# EAGLE board CajitaAbierta_v42 (EAGLE 9.6.2)
REV: A
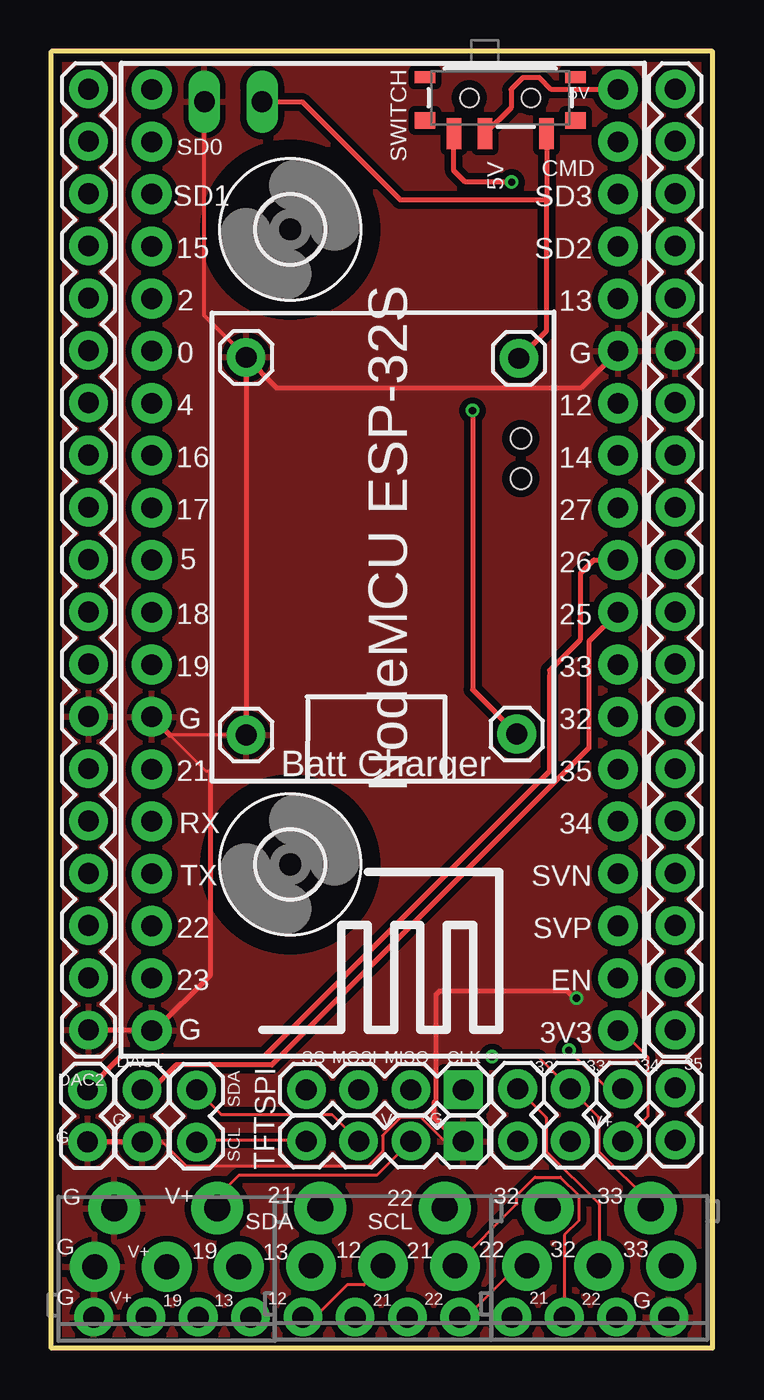
[diagram p0: board, top side]
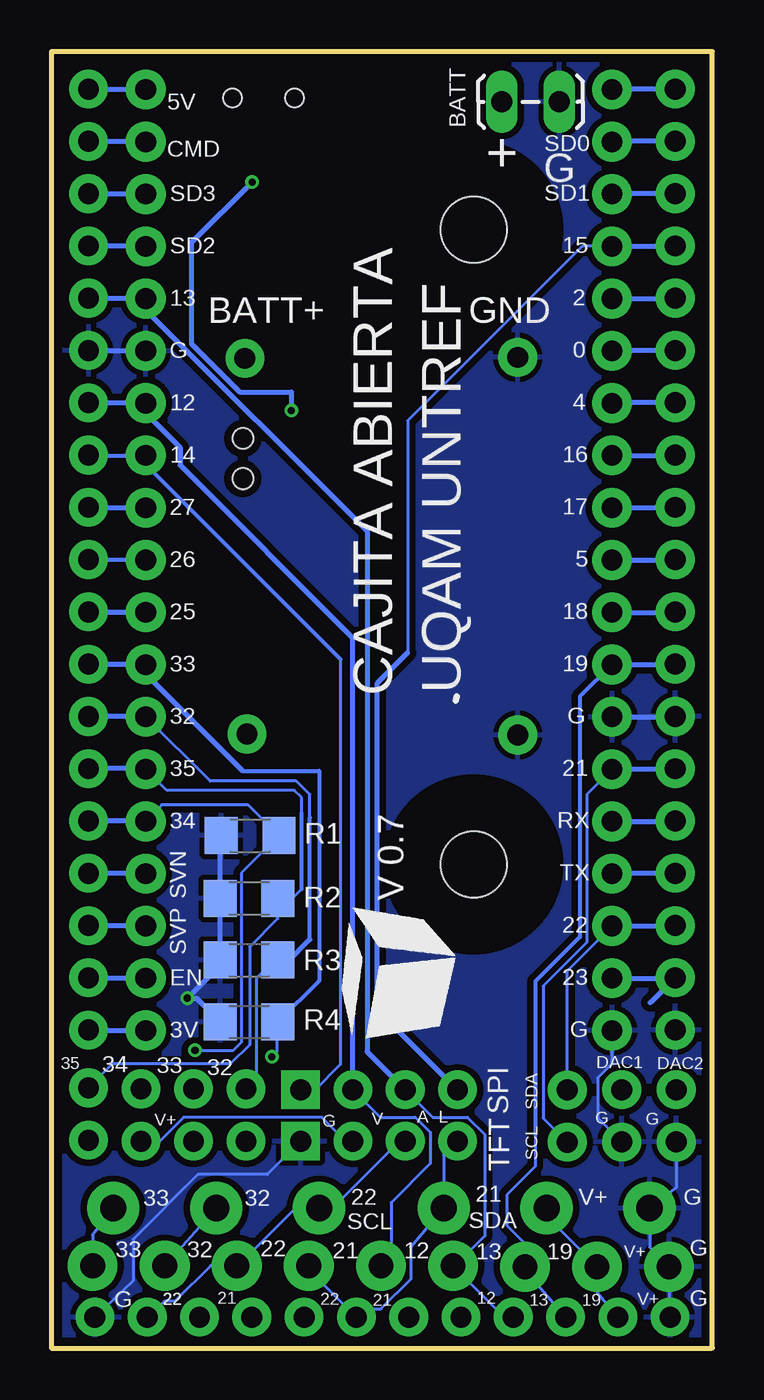
[diagram p1: board, bottom side, seen from below]

Size 32.1 x 63 mm. Coordinates in mm from the lower left corner, seen from the top.
Outline: 32.1,63 32.1,0 0,0 0,63 32.1,63
Copper layers (1*16): Top 0.035mm / dielectric 1.5mm / Bottom 0.035mm
Design rules "NOA Eagle Rule 2016-06-12": minimum track width 6mil, minimum drill 0.3mm, track to track 6mil, track to pad 6mil, pad to pad 6mil, via to via 6mil, smd to smd 0mil, copper to edge 0.4mm, drill to drill 10mil, minimum pad ring 10mil, minimum via ring 6mil, stop-mask expansion 2mil, vias tented up to drill 25mil, thermal gap 10mil
Holes 1 mm at 22.8,44.2 22.8,42.25

## Footprints (pad centres in the part's own frame; a part is rotated, then mirrored left to right if it is on the bottom)
1X01 = drill 1.016 pad 1.88: 1 0,0
1X02 = drill 1.016 pad 1.88: 1 0,0; 2 2.54,0
1X02_LOCK_LONGPADS = drill 1.016 long: 1 -0.127,0; 2 2.667,0
1X12_NO_SILK = drill 1.016 pad 1.88: 1 0,0; 2 2.54,0; 3 5.08,0; 4 7.62,0; 5 10.16,0; 6 12.7,0; 7 15.24,0; 8 17.78,0; 9 20.32,0; 10 22.86,0; 11 25.4,0; 12 27.94,0
1X19 = drill 1.016 pad 1.88: 1 0,0; 2 2.54,0; 3 5.08,0; 4 7.62,0; 5 10.16,0; 6 12.7,0; 7 15.24,0; 8 17.78,0; 9 20.32,0; 10 22.86,0; 11 25.4,0; 12 27.94,0; 13 30.48,0; 14 33.02,0; 15 35.56,0; 16 38.1,0; 17 40.64,0; 18 43.18,0; 19 45.72,0
1206 = smd 1.6 x 1.8: 1 -1.4,0; 2 1.4,0
1X04 = drill 1.016 pad 1.88 square: 1 0,0 | drill 1.016 pad 1.88: 2 2.54,0; 3 5.08,0; 4 7.62,0
SWITCH_SPST_SMD_A = smd 0.7 x 1.5: 1 -2.25,-1.75; 2 -0.75,-1.75; 3 2.25,-1.75 | smd 1 x 0.6: GND1 -3.65,1; GND3 3.65,1 | smd 1 x 0.8: GND2 -3.65,-1.1; GND4 3.65,-1.1 | hole 0.9: -1.5,0; 1.5,0
SCREWTERMINAL-3.5MM-3-NS = drill 1.2 pad 2.413: 1 0,0; 2 3.5,0; 3 7,0
3,2 = hole 3.2: 0,0
ESP32-DEVKITC = drill 1 pad 1.93: 1 -22.87,-11.42; 2 -20.33,-11.42; 3 -17.79,-11.42; 4 -15.25,-11.42; 5 -12.71,-11.42; 6 -10.17,-11.42; 7 -7.63,-11.42; 8 -5.09,-11.42; 9 -2.55,-11.42; 10 -0.01,-11.42; 11 2.53,-11.42; 12 5.07,-11.42; 13 7.61,-11.42; 14 10.15,-11.42; 15 12.69,-11.42; 16 15.23,-11.42; 17 17.77,-11.42; 18 20.31,-11.42; 19 22.85,-11.42; 20 22.85,11.23; 21 20.31,11.23; 22 17.77,11.23; 23 15.23,11.23; 24 12.69,11.23; 25 10.15,11.23; 26 7.61,11.23; 27 5.07,11.23; 28 2.53,11.23; 29 -0.01,11.23; 30 -2.55,11.23; 31 -5.09,11.23; 32 -7.63,11.23; 33 -10.17,11.23; 34 -12.71,11.23; 35 -15.25,11.23; 36 -17.79,11.23; 37 -20.33,11.23; 38 -22.87,11.23
SCREW_TERMINAL_3_POS_5MM = drill 1.27 pad 2.54: 1 0,0; 2 0,5; 3 0,10

## Placement (x,y rotation side)
5V_IN  5V_IN  [1X01]  22.6,29.84 0 top
32  [1X02]  22.65,10.05 90 top
33  [1X02]  25.2,10.05 90 top
34  [1X02]  27.75,10.05 90 top
35  [1X02]  30.3,10.1 90 top
BAT-  [1X01]  9.45,29.79 0 top
BATT  [1X02_LOCK_LONGPADS]  7.56,60.56 180 bottom
BATT+  [1X01]  22.7,48.09 0 top
DAC1  [1X02]  4.4,12.55 270 top
DAC2  [1X02]  1.75,12.55 270 top
GND  Batt Charger  [1X01]  9.45,48.14 0 top
I2C  [1X02]  7.05,10 90 top
J1  [1X12_NO_SILK]  2.05,1.5 0 top
JP9  [1X19]  30.3,15.45 90 top
JP10  [1X19]  1.8,15.45 90 top
R1  [1206]  22.45,24.9 0 bottom
R2  [1206]  22.5,21.85 0 bottom
R3  [1206]  22.5,18.85 0 bottom
R4  [1206]  22.5,15.85 0 bottom
SPI  [1X04]  20,12.55 180 top
SWITCH  [SWITCH_SPST_SMD_A]  21.8,60.75 0 top
T1  [SCREWTERMINAL-3.5MM-3-NS]  2.1,3.95 0 top
T2  [SCREWTERMINAL-3.5MM-3-NS]  12.6,4 0 top
T3  [SCREWTERMINAL-3.5MM-3-NS]  23.1,4 0 top
TFT  [1X04]  20,10.05 180 top
U$1  [3,2]  11.6,54.35 0 top
U$2  [3,2]  11.6,23.5 0 top
U$3  ESP32DEVKITC  [ESP32-DEVKITC]  16.1,38.3 90 top
U$4  SCREW_TERMINAL_3_POS_5MM  [SCREW_TERMINAL_3_POS_5MM]  3.05,6.8 270 top
U$5  SCREW_TERMINAL_3_POS_5MM  [SCREW_TERMINAL_3_POS_5MM]  19.1,6.8 270 top

## Library data of the parts
5V_IN 32-35 BAT- BATT BATT+ DAC1 DAC2 GND I2C J1 JP9 JP10 SPI T1-T3 TFT = SparkFun-Connectors
R1-R4 = SparkFun-Resistors
SWITCH = SparkFun-Switches; PROD_ID: SWCH-10651; SF_SKU: COM-10860
U$1 U$2 = holes
U$3 = ESP32-DEVKITC
U$4 U$5 = alx_lib

## Nets
3V3: 34.1 J1.2 JP9.1 T1.2 TFT.2 U$3.1 U$4.2
5V: JP9.19 SWITCH.2 U$3.19
5V_IN: 5V_IN.1 SWITCH.1
ADC4: 32.2 JP9.7 R3.2 T3.2 U$3.7 U$5.2
ADC5: 33.2 JP9.8 R4.2 T3.3 U$3.8 U$5.3
ADC6: 34.2 JP9.5 R1.2 U$3.5
ADC7: 35.2 JP9.6 R2.2 U$3.6
BATT+: BATT+.1 BATT.2 SWITCH.3
CLK: JP10.19 U$3.20
CMD: JP9.18 U$3.18
D1: JP10.2 U$3.37
D2: J1.3 JP10.8 T1.3 U$3.31
D3: JP10.9 U$3.30
D4: JP10.10 U$3.29
D5: JP10.13 U$3.26
D6: JP10.14 U$3.25
D7: JP9.11 U$3.11
D8: JP10.15 U$3.24
DAC1: DAC1.1 JP9.9 U$3.9
DAC2: DAC2.1 JP9.10 U$3.10
EN: JP9.2 U$3.2
GND: BAT-.1 BATT.1 DAC1.2 DAC2.2 GND.1 J1.1 J1.12 JP9.14 JP10.1 JP10.7 R1.1 R2.1 R3.1 R4.1 T1.1 TFT.1 U$3.14 U$3.32 U$3.38 U$4.1
I2C_SCL: I2C.2 J1.8 J1.11 JP10.3 T3.1 TFT.3 U$3.36 U$5.1
I2C_SDA: I2C.1 J1.7 J1.10 JP10.6 T2.3 TFT.4 U$3.33 U$4.3
IO16: JP10.12 U$3.27
IO17: JP10.11 U$3.28
MISO: J1.5 JP9.13 SPI.2 T2.2 U$3.13
MOSI: J1.4 JP9.15 SPI.3 T2.1 U$3.15
N$14: J1.6
N$17: J1.9
RXD0: JP10.5 U$3.34
SD0: JP10.18 U$3.21
SD1: JP10.17 U$3.22
SD2: JP9.16 U$3.16
SD3: JP9.17 U$3.17
SPI_CLK: JP9.12 SPI.1 U$3.12
SPI_SS: JP10.16 SPI.4 U$3.23
SVN: JP9.4 U$3.4
SVP: JP9.3 U$3.3
TXD0: JP10.4 U$3.35

## Tracks (layer width: path | path; a pad name or v marks a point on that pad's centre or on a via)
3V3
  Top 0.152: U$3.1 27.67,15.43 28.95,14.15 28.95,11.25 34.1 27.8,10.1 | TFT.2 15.81,8.4 9.1,8.4 8.05,7.35 U$4.2
  Bottom 0.152: U$4.2 8.05,6.4 T1.2 5.6,2.71 J1.2 | TFT.2 17.8,10.05 18.97,11.22 25.68,11.22 26.85,10.05 34.1
  Bottom 0.254: JP9.1 30.28,15.43 U$3.1
5V
  Top 0.254: U$3.19 24.28,61.15 23.7,61.73 22.89,61.73 22.32,61.16 22.32,60.27 SWITCH.2
  Bottom 0.254: U$3.19 30.28,61.15 JP9.19
5V_IN  (via drill 0.35)
  Top 0.254: v20.45,45.55 20.45,31.99 5V_IN.1 | v22.35,56.65 20.1,56.65 19.55,57.2 SWITCH.1
  Bottom 0.254: v22.35,56.65 25.3,53.7 25.3,48.8 22.95,46.45 20.45,46.45 v20.45,45.55
ADC4
  Top 0.152: 32.2 24.03,11.21 24.03,9.57 26.6,7 T3.2
  Bottom 0.152: 21.2,18.75 R3.2 21.26,18.85 22.15,17.96 22.15,13.09 32.2 | 19.55,25.78 19.55,26.9 20.2,27.55 24.4,27.55 27.54,30.69 | U$5.2 T3.2
  Bottom 0.2: 19.55,19.85 19.55,25.78
  Bottom 0.254: U$3.7 27.54,30.69 JP9.7 | 19.55,19.85 20.65,18.75 21.2,18.75
ADC5  (via drill 0.35)
  Top 0.152: v21.4,14.15 23.64,14.15 33.2 26.58,11.21 26.58,9.57 29.1,7.05 U$5.3
  Bottom 0.152: R4.2 21.15,15.8 21.15,14.4 v21.4,14.15 | U$5.3 30.1,5.5 T3.3
  Bottom 0.2: 22.8,28.04 19.1,28.04 19.1,17.85 R4.2
  Bottom 0.254: 22.8,28.04 27.52,32.76 U$3.8 27.54,33.23 JP9.8
ADC6  (via drill 0.35)
  Top 0.152: 34.2 27.01,12.59 v25.13,14.47
  Bottom 0.152: v25.13,14.47 23.26,14.47 22.87,14.86 22.87,23.08 R1.2 22.55,26.4 26.75,26.4 27.54,25.61
  Bottom 0.254: U$3.5 27.54,25.61 JP9.5
ADC7
  Bottom 0.152: 19.95,22.3 20.4,21.85 R2.2 21.1,20.87 22.48,19.49 22.48,14.73 23.41,13.8 29.14,13.8 35.2 | 19.95,25.99 19.95,26.75 20.3,27.1 26.49,27.1 U$3.6
  Bottom 0.2: 19.95,22.3 19.95,25.99
  Bottom 0.254: U$3.6 27.54,28.15 JP9.6
BATT+
  Top 0.254: 24.05,55.85 24.11,55.79 16.94,55.79 12.18,60.56 BATT.2 | SWITCH.3 24.05,55.85 | BATT+.1 24.05,49.43 24.05,55.85
CLK
  Bottom 0.254: JP10.19 4.85,61.17 U$3.20
CMD
  Bottom 0.254: U$3.18 30.28,58.61 JP9.18
D1
  Bottom 0.254: 3.02,16.77 JP10.2 1.82,17.97 U$3.37
D2
  Bottom 0.152: 8.59,10.41 8.59,8.84 9.98,7.44 9.98,5.96 9.1,5.07 T1.3 9.1,3.77 J1.3
  Bottom 0.2: U$3.31 6.43,31.65 6.43,19.97 8.59,17.81 8.59,10.41
  Bottom 0.254: U$3.31 1.82,33.21 JP10.8
D3
  Bottom 0.254: JP10.9 1.82,35.75 U$3.30
D4
  Bottom 0.254: U$3.29 1.82,38.29 JP10.10
D5
  Bottom 0.254: JP10.13 4.85,45.93 U$3.26
D6
  Bottom 0.254: JP10.14 4.85,48.47 U$3.25
D7
  Bottom 0.254: JP9.11 30.28,40.83 U$3.11
D8
  Bottom 0.254: U$3.24 1.82,50.99 JP10.15
DAC1
  Top 0.254: U$3.9 26.11,34.34 26.11,29.16 10.71,13.76 6.04,13.76 4.84,12.55 DAC1.1
  Bottom 0.254: U$3.9 30.28,35.75 JP9.9
DAC2
  Top 0.2: 24.2,32.67 24.2,32.92
  Top 0.254: 24.2,32.92 25.7,34.43 25.7,37.65 26.34,38.29 U$3.10 | DAC2.1 3.38,14.19 5.39,14.19 5.4,14.2 10.35,14.2 24.2,28.05 24.2,32.67
  Bottom 0.2: U$3.10 30.28,38.29 JP9.10
EN
  Bottom 0.254: U$3.2 30.28,17.97 JP9.2
GND  (via drill 0.35)
  Top 0.152: 7.7,28.04 7.5,28.04 5.75,29.79 BAT-.1 | TFT.1 19.11,10.05 17.94,11.22 16.98,11.22 16.09,10.33 16.09,9.57 15.35,8.83 6.57,8.83 5.39,10.01 DAC1.2
  Top 0.2: GND.1 7.43,50.16 BATT.1
  Top 0.254: DAC1.2 DAC2.2 | U$3.14 25.72,46.65 10.94,46.65 GND.1 BAT-.1 | U$3.32 5.75,29.79 | JP10.1 4.85,15.45 U$3.38 5.02,15.43 7.7,18.11 7.7,28.04 | TFT.1 19.75,10.05 18.6,11.2 18.6,11.97 18.68,12.04 18.68,17.18 18.85,17.35 25.05,17.35 25.3,17.1 25.3,17 v25.5,17
  Bottom 0.152: U$3.38 4.87,13.83 5.57,13.13 5.57,11.18 DAC1.2 | DAC2.2 1.75,7.8 U$4.1 3.05,4.9 T1.1 2.1,1.75 J1.1 | TFT.1 21.61,8.44 24.99,8.44 28.14,5.29 28.14,3.26 J1.12
  Bottom 0.254: U$3.32 1.82,30.67 JP10.7 | JP9.14 27.54,48.47 U$3.14 | R4.1 25.05,17 v25.5,17 23.9,18.6 R3.1 R2.1 23.9,24.85 R1.1
  pour Top (isolate 0.305): 32.1,0 0,0 0,63 32.1,63
  pour Bottom (isolate 0.305): 32.1,0 0,0 0,63 32.1,63
I2C_SCL
  Top 0.152: I2C.2 8.24,11.35 13.62,11.35 TFT.3 | T3.1 22.65,4 20.15,1.5 J1.8
  Bottom 0.152: I2C.2 7.05,18.33 U$3.36 | TFT.3 15.22,10.05 18.47,6.8 U$5.1 20.05,6.8 20.3,6.75 23.05,4 T3.1 24.37,4 26.11,2.27 26.61,2.27 J1.11
  Bottom 0.254: JP10.3 1.82,20.51 U$3.36
I2C_SDA
  Top 0.152: 12.33,10.1 TFT.4 11.53,10.05 11.48,10.1 7.15,10.1 I2C.1 | J1.10 24.91,5.49 25.6,6.18 25.6,7.42 24.72,8.3 23.48,8.3 22.6,7.42 22.6,7 T2.3
  Bottom 0.152: U$3.33 6.1,26.9 6.1,19.71 8.22,17.59 8.22,11.17 I2C.1 | TFT.4 13.05,9.38 U$4.3 14.65,4.9 14.65,3.35 16.1,1.9 16.89,1.9 J1.7 19.6,3.81 T2.3
  Bottom 0.254: U$3.33 1.82,28.13 JP10.6
IO16
  Bottom 0.254: U$3.27 1.82,43.37 JP10.12
IO17
  Bottom 0.254: U$3.28 1.82,40.83 JP10.11
MISO
  Top 0.152: T2.2 15.17,3.07 14.37,3.07 12.8,1.5 J1.5
  Bottom 0.152: T2.2 15.6,4.5 15.6,7.07 13.7,8.97 13.7,10.48 14.44,11.22 16.13,11.22 SPI.2
  Bottom 0.254: JP9.13 30.28,45.91 U$3.13 27.52,45.42 25.85,43.75 25.85,42.9 17.46,34.51 SPI.2
MOSI
  Bottom 0.152: 14.88,12.55 SPI.3 13.59,11.22 11.9,11.22 11.05,10.37 11.05,5.45 12.5,4 T2.1 10.1,1.5 J1.4
  Bottom 0.254: JP9.15 30.28,50.99 U$3.15 27.52,50.44 16.77,39.69 16.77,14.4 SPI.3
RXD0
  Bottom 0.254: U$3.34 1.82,25.59 JP10.5
SD0
  Bottom 0.254: JP10.18 4.85,58.63 U$3.21
SD1
  Bottom 0.254: JP10.17 4.85,56.09 U$3.22
SD2
  Bottom 0.254: U$3.16 30.28,53.53 JP9.16
SD3
  Bottom 0.254: U$3.17 30.28,56.07 JP9.17
SPI_CLK
  Bottom 0.152: SPI.1 19.3,12.55 18.07,13.78 18.07,33.47
  Bottom 0.2: JP9.12 30.28,43.37 U$3.12 27.52,42.92 18.07,33.47
SPI_SS
  Bottom 0.152: U$3.23 6.32,53.53 14.8,45.05 14.8,33.78
  Bottom 0.254: SPI.4 16.3,16.47 16.3,32.28 14.8,33.78 | U$3.23 1.82,53.53 JP10.16
SVN
  Bottom 0.254: U$3.4 30.28,23.05 JP9.4
SVP
  Bottom 0.254: U$3.3 30.28,20.51 JP9.3
TXD0
  Bottom 0.254: JP10.4 4.85,23.07 U$3.35

## Text on the board
tNames: 5V | DAC1 | SS | MOSI | MISO | CLK | DAC2 | 34 | SDA | G | V | G | V+ | G | SCL | G | V+ | 21 | SDA | 22 | SCL | 32 | 33 | G | V+ | 19 | 13 | 12 | 21 | 22 | 32 | 33 | G | V+ | 19 | 13 | 12 | 21 | 22 | 21 | 22 | G
bNames: G | + | UQAM UNTREF | GND | BATT+ | CAJITA ABIERTA | V 0.7 | DAC2 | DAC1 | 35 | SDA | 32 | 33 | 34 | G | G | SCL | SPI | A L | V | G | V+ | TFT | G | V+ | SDA | 21 | SCL | 22 | 32 | 33 | G | V+ | 19 | 13 | 12 | 21 | 22 | 32 | 33 | G | V+ | 19 | 13 | 12 | 21 | 22 | 21 | 22 | 22 | G
uqam: v0.2
noms_b: V+ | 3V3 | G | D4 | D7 | D2 | A0
192bmp: /Users/uqam/Desktop/ohanda_logo.bmp
noms_t: G | DHT11 | D7 | SPKR | 3V | A0 | D2 | G | DEL | V+ | D2 | A0 | D4 | D7 | G | G | V+ | 3V3 | V+ | MQ-7 | V+ | PWR | G
225bmp: /Users/uqam/Documents/AgitPOV_WiFi/logo_texte_gagarin.bmp